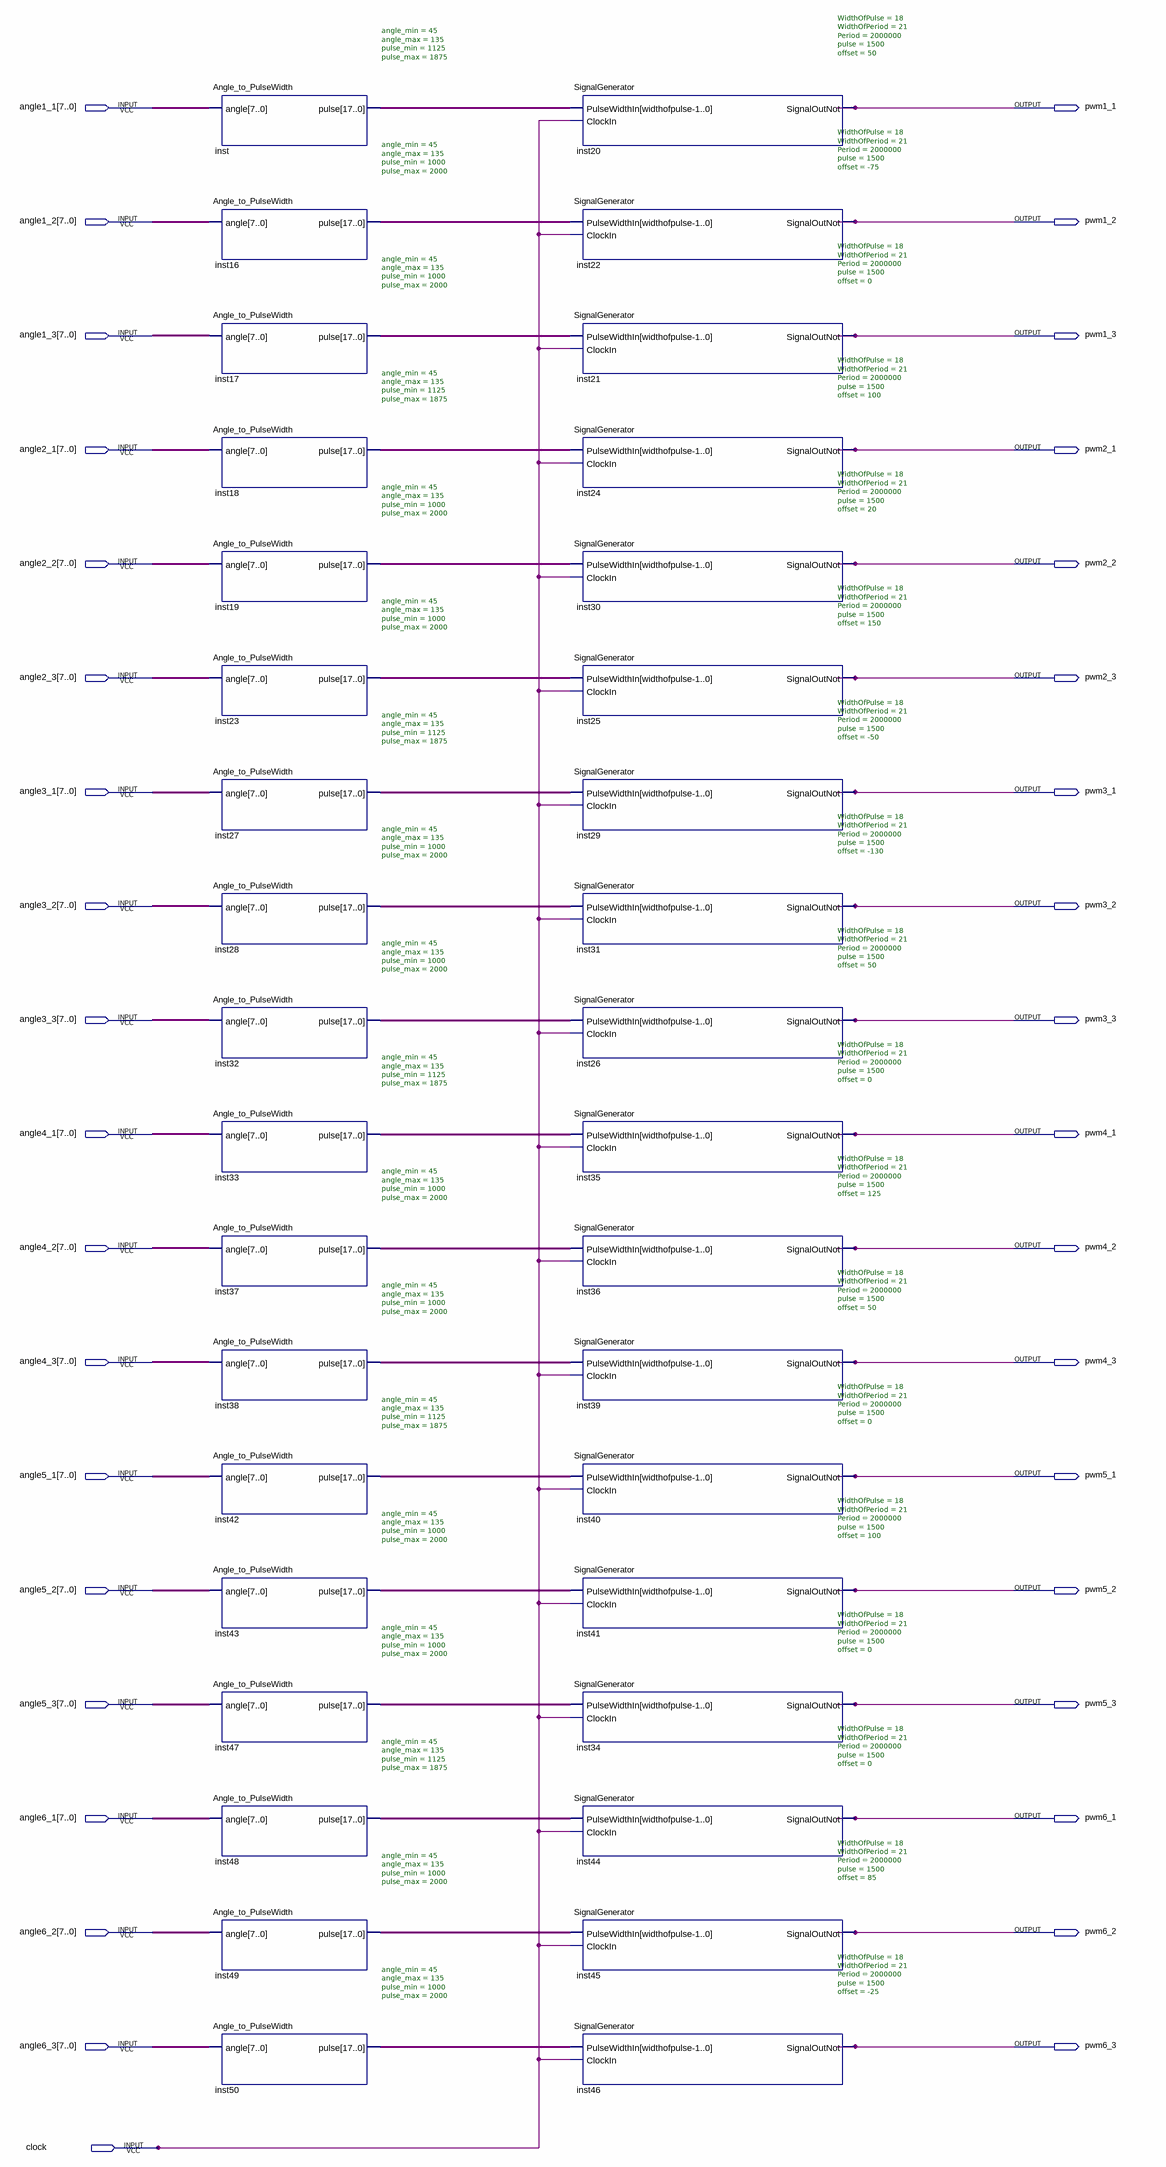
[diagram p0: schematic sheet]
// Quartus schematic bot_angle_to_pulse.bdf as structural Verilog: 36 symbols, 37 pins
module bot_angle_to_pulse (
  input  [7:0] angle1_1,
  input  [7:0] angle1_2,
  input  [7:0] angle1_3,
  input  [7:0] angle2_1,
  input  [7:0] angle2_2,
  input  [7:0] angle2_3,
  input  [7:0] angle3_1,
  input  [7:0] angle3_2,
  input  [7:0] angle3_3,
  input  [7:0] angle4_1,
  input  [7:0] angle4_2,
  input  [7:0] angle4_3,
  input  [7:0] angle5_1,
  input  [7:0] angle5_2,
  input  [7:0] angle5_3,
  input  [7:0] angle6_1,
  input  [7:0] angle6_2,
  input  [7:0] angle6_3,
  input  clock,
  output pwm1_1,
  output pwm1_2,
  output pwm1_3,
  output pwm2_1,
  output pwm2_2,
  output pwm2_3,
  output pwm3_1,
  output pwm3_2,
  output pwm3_3,
  output pwm4_1,
  output pwm4_2,
  output pwm4_3,
  output pwm5_1,
  output pwm5_2,
  output pwm5_3,
  output pwm6_1,
  output pwm6_2,
  output pwm6_3
);

  wire [17:0] inst16_pulse, inst17_pulse, inst18_pulse, inst19_pulse, inst23_pulse, inst27_pulse,
       inst28_pulse, inst32_pulse, inst33_pulse, inst37_pulse, inst38_pulse, inst42_pulse, inst43_pulse,
       inst47_pulse, inst48_pulse, inst49_pulse, inst50_pulse, inst_pulse;

  Angle_to_PulseWidth #(.angle_min(45), .angle_max(135), .pulse_min(1125), .pulse_max(1875)) inst (
    .angle(angle1_1), .pulse(inst_pulse));
  Angle_to_PulseWidth #(.angle_min(45), .angle_max(135), .pulse_min(1000), .pulse_max(2000)) inst16 (
    .angle(angle1_2), .pulse(inst16_pulse));
  Angle_to_PulseWidth #(.angle_min(45), .angle_max(135), .pulse_min(1000), .pulse_max(2000)) inst17 (
    .angle(angle1_3), .pulse(inst17_pulse));
  Angle_to_PulseWidth #(.angle_min(45), .angle_max(135), .pulse_min(1125), .pulse_max(1875)) inst18 (
    .angle(angle2_1), .pulse(inst18_pulse));
  Angle_to_PulseWidth #(.angle_min(45), .angle_max(135), .pulse_min(1000), .pulse_max(2000)) inst19 (
    .angle(angle2_2), .pulse(inst19_pulse));
  Angle_to_PulseWidth #(.angle_min(45), .angle_max(135), .pulse_min(1000), .pulse_max(2000)) inst23 (
    .angle(angle2_3), .pulse(inst23_pulse));
  Angle_to_PulseWidth #(.angle_min(45), .angle_max(135), .pulse_min(1125), .pulse_max(1875)) inst27 (
    .angle(angle3_1), .pulse(inst27_pulse));
  Angle_to_PulseWidth #(.angle_min(45), .angle_max(135), .pulse_min(1000), .pulse_max(2000)) inst28 (
    .angle(angle3_2), .pulse(inst28_pulse));
  Angle_to_PulseWidth #(.angle_min(45), .angle_max(135), .pulse_min(1000), .pulse_max(2000)) inst32 (
    .angle(angle3_3), .pulse(inst32_pulse));
  Angle_to_PulseWidth #(.angle_min(45), .angle_max(135), .pulse_min(1125), .pulse_max(1875)) inst33 (
    .angle(angle4_1), .pulse(inst33_pulse));
  Angle_to_PulseWidth #(.angle_min(45), .angle_max(135), .pulse_min(1000), .pulse_max(2000)) inst37 (
    .angle(angle4_2), .pulse(inst37_pulse));
  Angle_to_PulseWidth #(.angle_min(45), .angle_max(135), .pulse_min(1000), .pulse_max(2000)) inst38 (
    .angle(angle4_3), .pulse(inst38_pulse));
  Angle_to_PulseWidth #(.angle_min(45), .angle_max(135), .pulse_min(1125), .pulse_max(1875)) inst42 (
    .angle(angle5_1), .pulse(inst42_pulse));
  Angle_to_PulseWidth #(.angle_min(45), .angle_max(135), .pulse_min(1000), .pulse_max(2000)) inst43 (
    .angle(angle5_2), .pulse(inst43_pulse));
  Angle_to_PulseWidth #(.angle_min(45), .angle_max(135), .pulse_min(1000), .pulse_max(2000)) inst47 (
    .angle(angle5_3), .pulse(inst47_pulse));
  Angle_to_PulseWidth #(.angle_min(45), .angle_max(135), .pulse_min(1125), .pulse_max(1875)) inst48 (
    .angle(angle6_1), .pulse(inst48_pulse));
  Angle_to_PulseWidth #(.angle_min(45), .angle_max(135), .pulse_min(1000), .pulse_max(2000)) inst49 (
    .angle(angle6_2), .pulse(inst49_pulse));
  Angle_to_PulseWidth #(.angle_min(45), .angle_max(135), .pulse_min(1000), .pulse_max(2000)) inst50 (
    .angle(angle6_3), .pulse(inst50_pulse));
  SignalGenerator #(.WidthOfPulse(18), .WidthOfPeriod(21), .Period(2000000), .pulse(1500), .offset(50)) inst20 (
    .PulseWidthIn(inst_pulse), .ClockIn(clock), .SignalOutNot(pwm1_1));
  SignalGenerator #(.WidthOfPulse(18), .WidthOfPeriod(21), .Period(2000000), .pulse(1500), .offset(-75)) inst22 (
    .PulseWidthIn(inst16_pulse), .ClockIn(clock), .SignalOutNot(pwm1_2));
  SignalGenerator #(.WidthOfPulse(18), .WidthOfPeriod(21), .Period(2000000), .pulse(1500), .offset(0)) inst21 (
    .PulseWidthIn(inst17_pulse), .ClockIn(clock), .SignalOutNot(pwm1_3));
  SignalGenerator #(.WidthOfPulse(18), .WidthOfPeriod(21), .Period(2000000), .pulse(1500), .offset(100)) inst24 (
    .PulseWidthIn(inst18_pulse), .ClockIn(clock), .SignalOutNot(pwm2_1));
  SignalGenerator #(.WidthOfPulse(18), .WidthOfPeriod(21), .Period(2000000), .pulse(1500), .offset(20)) inst30 (
    .PulseWidthIn(inst19_pulse), .ClockIn(clock), .SignalOutNot(pwm2_2));
  SignalGenerator #(.WidthOfPulse(18), .WidthOfPeriod(21), .Period(2000000), .pulse(1500), .offset(150)) inst25 (
    .PulseWidthIn(inst23_pulse), .ClockIn(clock), .SignalOutNot(pwm2_3));
  SignalGenerator #(.WidthOfPulse(18), .WidthOfPeriod(21), .Period(2000000), .pulse(1500), .offset(-50)) inst29 (
    .PulseWidthIn(inst27_pulse), .ClockIn(clock), .SignalOutNot(pwm3_1));
  SignalGenerator #(.WidthOfPulse(18), .WidthOfPeriod(21), .Period(2000000), .pulse(1500), .offset(-130)) inst31 (
    .PulseWidthIn(inst28_pulse), .ClockIn(clock), .SignalOutNot(pwm3_2));
  SignalGenerator #(.WidthOfPulse(18), .WidthOfPeriod(21), .Period(2000000), .pulse(1500), .offset(50)) inst26 (
    .PulseWidthIn(inst32_pulse), .ClockIn(clock), .SignalOutNot(pwm3_3));
  SignalGenerator #(.WidthOfPulse(18), .WidthOfPeriod(21), .Period(2000000), .pulse(1500), .offset(0)) inst35 (
    .PulseWidthIn(inst33_pulse), .ClockIn(clock), .SignalOutNot(pwm4_1));
  SignalGenerator #(.WidthOfPulse(18), .WidthOfPeriod(21), .Period(2000000), .pulse(1500), .offset(125)) inst36 (
    .PulseWidthIn(inst37_pulse), .ClockIn(clock), .SignalOutNot(pwm4_2));
  SignalGenerator #(.WidthOfPulse(18), .WidthOfPeriod(21), .Period(2000000), .pulse(1500), .offset(50)) inst39 (
    .PulseWidthIn(inst38_pulse), .ClockIn(clock), .SignalOutNot(pwm4_3));
  SignalGenerator #(.WidthOfPulse(18), .WidthOfPeriod(21), .Period(2000000), .pulse(1500), .offset(0)) inst40 (
    .PulseWidthIn(inst42_pulse), .ClockIn(clock), .SignalOutNot(pwm5_1));
  SignalGenerator #(.WidthOfPulse(18), .WidthOfPeriod(21), .Period(2000000), .pulse(1500), .offset(100)) inst41 (
    .PulseWidthIn(inst43_pulse), .ClockIn(clock), .SignalOutNot(pwm5_2));
  SignalGenerator #(.WidthOfPulse(18), .WidthOfPeriod(21), .Period(2000000), .pulse(1500), .offset(0)) inst34 (
    .PulseWidthIn(inst47_pulse), .ClockIn(clock), .SignalOutNot(pwm5_3));
  SignalGenerator #(.WidthOfPulse(18), .WidthOfPeriod(21), .Period(2000000), .pulse(1500), .offset(0)) inst44 (
    .PulseWidthIn(inst48_pulse), .ClockIn(clock), .SignalOutNot(pwm6_1));
  SignalGenerator #(.WidthOfPulse(18), .WidthOfPeriod(21), .Period(2000000), .pulse(1500), .offset(85)) inst45 (
    .PulseWidthIn(inst49_pulse), .ClockIn(clock), .SignalOutNot(pwm6_2));
  SignalGenerator #(.WidthOfPulse(18), .WidthOfPeriod(21), .Period(2000000), .pulse(1500), .offset(-25)) inst46 (
    .PulseWidthIn(inst50_pulse), .ClockIn(clock), .SignalOutNot(pwm6_3));
endmodule
